# EAGLE design xnemo_r1-1 (EAGLE 6.2)
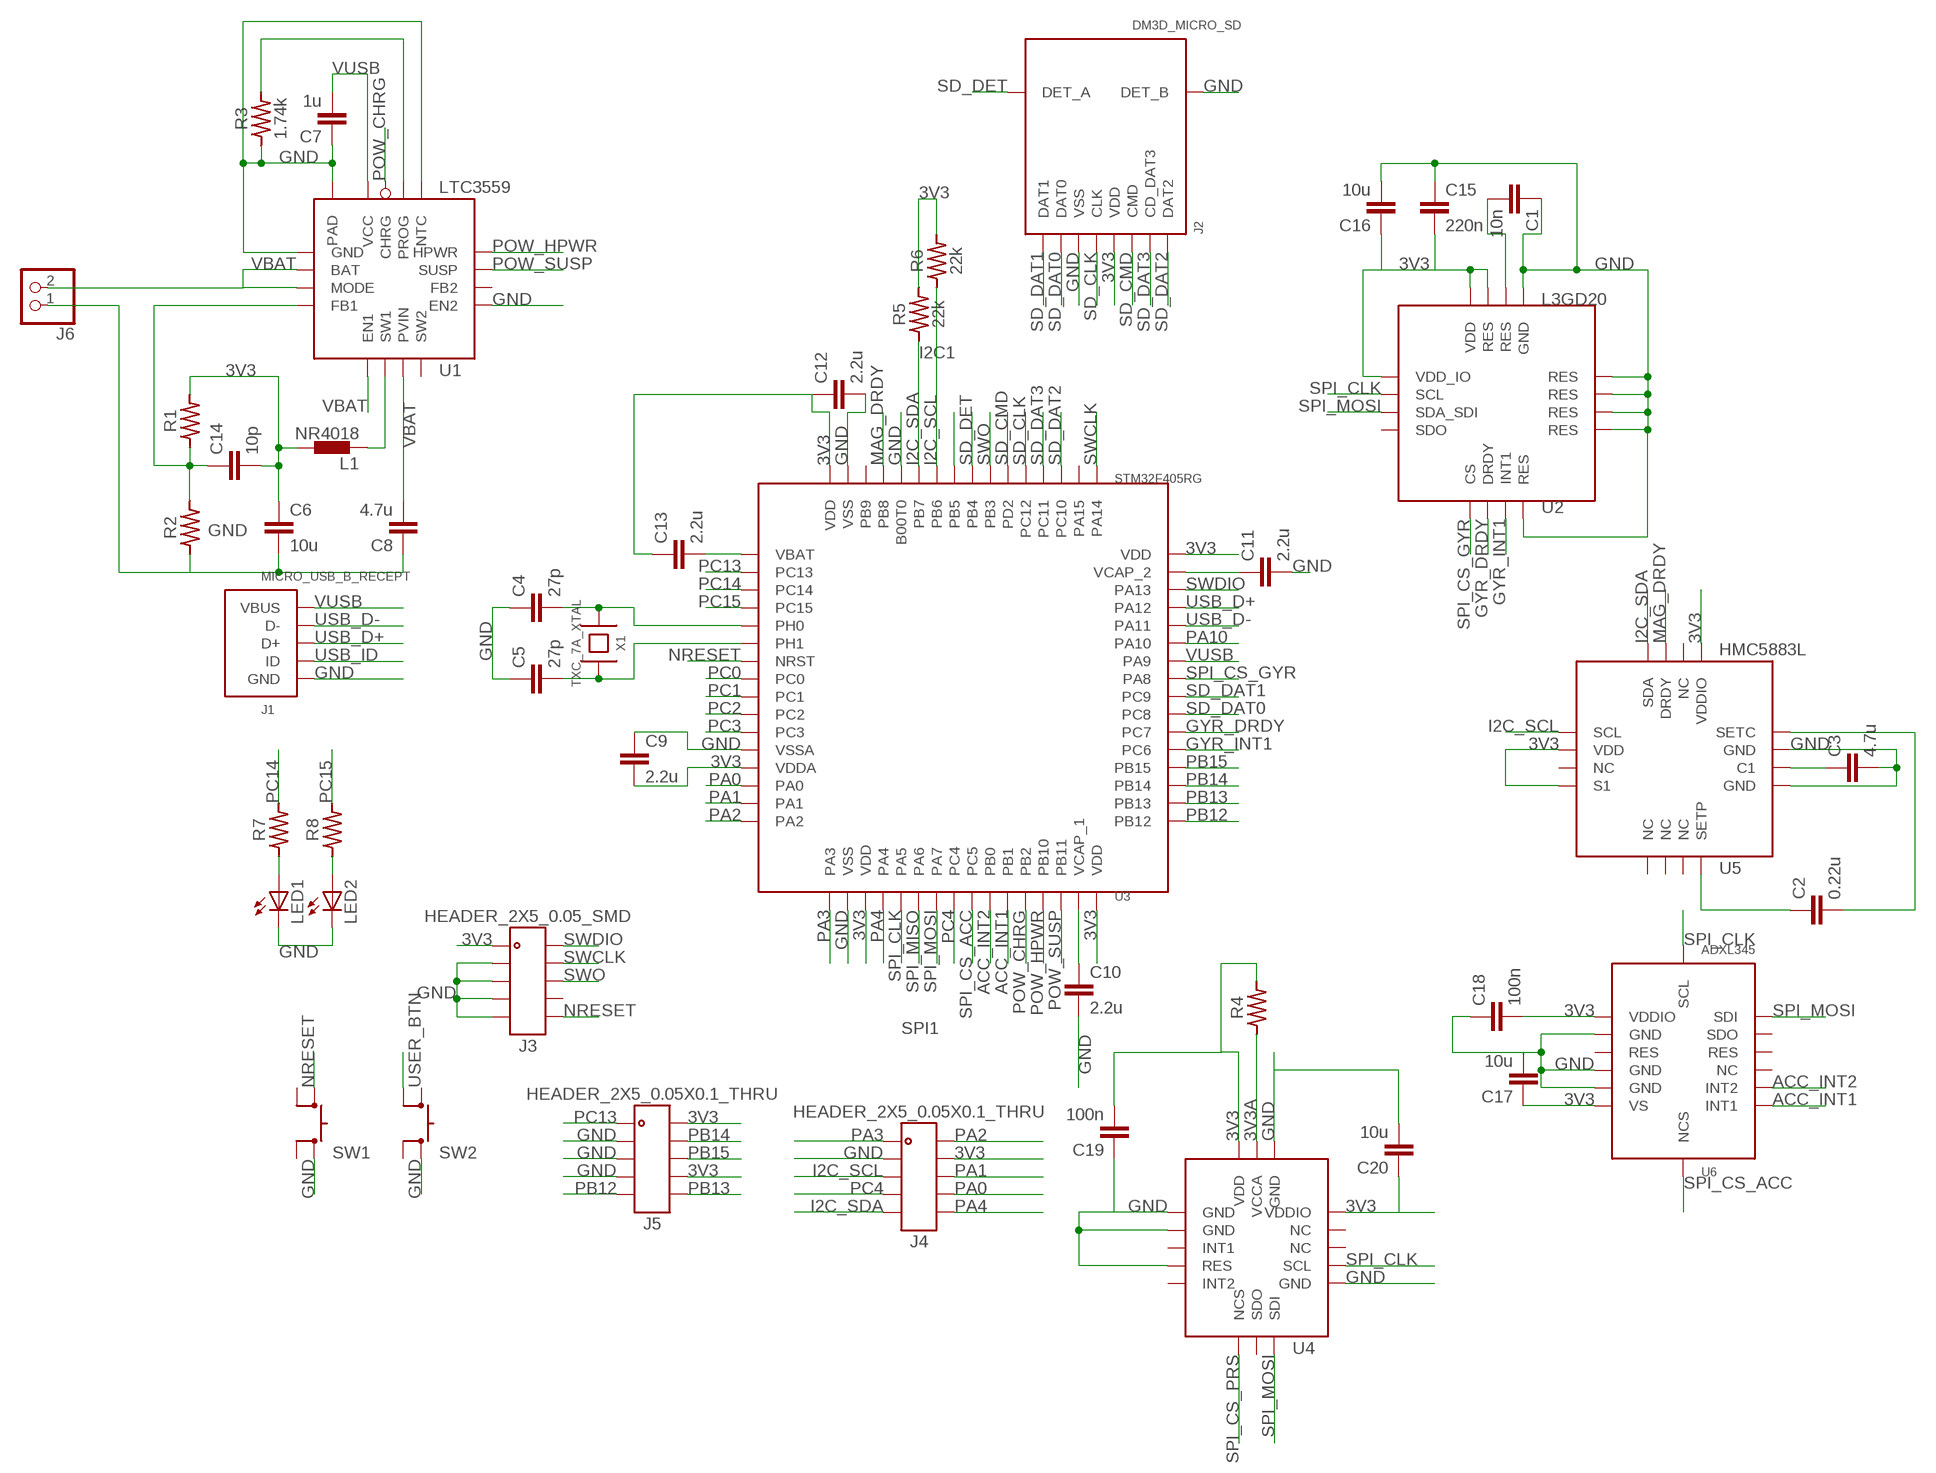
[diagram p0: schematic, sheet 1]

## Parts
C1  10n  C-EUC0402  [C0402]
C2  0.22u  C-EUC0402  [C0402]
C3  4.7u  C-EUC0805  [C0805]
C4  27p  C-EUC0402  [C0402]
C5  27p  C-EUC0402  [C0402]
C6  10u  C-EUC0805  [C0805]
C7  1u  C-EUC0603  [C0603]
C8  4.7u  C-EUC0805  [C0805]
C9  2.2u  C-EUC0603  [C0603]
C10  2.2u  C-EUC0603  [C0603]
C11  2.2u  C-EUC0603  [C0603]
C12  2.2u  C-EUC0603  [C0603]
C13  2.2u  C-EUC0603  [C0603]
C14  10p  C-EUC0402  [C0402]
C15  220n  C-EUC0402  [C0402]
C16  10u  C-EUC0805  [C0805]
C17  10u  C-EUC0805  [C0805]
C18  100n  C-EUC0402  [C0402]
C19  100n  C-EUC0402  [C0402]
C20  10u  C-EUC0805  [C0805]
J1  MICRO_USB_B_RECEPT  [FCI_MICRO_USB_B]
J2  DM3D_MICRO_SD  [HIROSE_DM3D]
J3  HEADER_2X5_0.05_SMD  [HEADER_2X5_0.05_SMD]
J4  HEADER_2X5_0.05X0.1_THRU  [HEADER_2X5_0.05X0.1_THRU]
J5  HEADER_2X5_0.05X0.1_THRU  [HEADER_2X5_0.05X0.1_THRU]
J6  PINHD-1X2  [1X02]
L1  NR4018  [L_401X]
LED1  LEDCHIPLED_0603  [CHIPLED_0603]
LED2  LEDCHIPLED_0603  [CHIPLED_0603]
R1  RESISTOR-0402  [SMD0402]
R2  RESISTOR-0402  [SMD0402]
R3  1.74k  RESISTOR-0402  [SMD0402]
R4  RESISTOR-0603  [SMD0603]
R5  22k  RESISTOR-0402  [SMD0402]
R6  22k  RESISTOR-0402  [SMD0402]
R7  RESISTOR-0402  [SMD0402]
R8  RESISTOR-0402  [SMD0402]
SW1  ALPS_SKQG  [ALPS_SKQG]
SW2  ALPS_SKQG  [ALPS_SKQG]
U1  LTC3559  [LT_QFN16_3X3]
U2  L3GD20  [ST_LGA16_4X4]
U3  STM32F405RG  [ST_LQFP64]
U4  LPS331AP  [ST_HCLGA-16L]
U5  HMC5883L  [HW_LCC16_3X3]
U6  ADXL345  [AD_LGA14_3X5]
X1  TXC_7A_XTAL  [TXC_7A_XTAL]

## Nets
3V3 [power]: C6.1 C9.2 C12.1 C13.1 C14.2 C15.2 C16.1 C17.1 C18.2 C19.2 C20.1 J2.P$5(VDD) J3.1 J4.4 J5.2 J5.8 L1.P$2 R1.P$1 R4.P$1 R5.P$1 R6.P$1 U2.P$1(VDD_IO) U2.P$15(RES) U2.P$16(VDD) U3.P$13(VDDA) U3.P$19(VDD) U3.P$32(VDD) U3.P$48(VDD) U3.P$64(VDD) U4.P$1(VDDIO) U4.P$14(VDD) U5.P$2(VDD) U5.P$4(S1) U5.P$13(VDDIO) U6.P$1(VDDIO) U6.P$6(VS)
3V3A: R4.P$2 U4.P$15(VCCA)
ACC_INT1: U3.P$27(PB1) U6.P$8(INT1)
ACC_INT2: U3.P$26(PB0) U6.P$9(INT2)
BUCK_FB1: C14.1 R1.P$2 R2.P$1 U1.P$4(FB1)
BUCK_SW1: L1.P$1 U1.P$6(SW1)
GND: C1.1 C3.2 C4.1 C5.1 C6.2 C7.1 C8.1 C9.1 C10.2 C11.2 C12.2 C15.1 C16.2 C17.2 C18.1 C19.1 C20.2 J1.P$5(GND) J2.P$3(VSS) J2.P$9(DET_B) J3.3 J3.5 J3.7 J3.9 J4.3 J5.3 J5.5 J5.7 J6.1 LED1.C LED2.C R2.P$2 R3.P$2 SW1.2_2 SW2.2_2 U1.P$1(GND) U1.P$9(EN2) U1.P$13(NTC) U1.P$17(PAD) U2.P$8(RES) U2.P$9(RES) U2.P$10(RES) U2.P$11(RES) U2.P$12(RES) U2.P$13(GND) U3.P$12(VSSA) U3.P$18(VSS) U3.P$60(B00T0) U3.P$63(VSS) U4.P$5(GND) U4.P$10(RES) U4.P$12(GND) U4.P$13(GND) U4.P$16(GND) U5.P$9(GND) U5.P$11(GND) U6.P$2(GND) U6.P$4(GND) U6.P$5(GND)
GYR_DRDY: U2.P$6(DRDY) U3.P$38(PC7)
GYR_INT1: U2.P$7(INT1) U3.P$37(PC6)
GYR_RES: C1.2 U2.P$14(RES)
I2C_SCL [data]: J4.5 R6.P$2 U3.P$58(PB6) U5.P$1(SCL)
I2C_SDA [data]: J4.9 R5.P$2 U3.P$59(PB7) U5.P$16(SDA)
MAG_C1: C3.1 U5.P$10(C1)
MAG_DRDY: U3.P$61(PB8) U5.P$15(DRDY)
MAG_SETC: C2.2 U5.P$12(SETC)
MAG_SETP: C2.1 U5.P$8(SETP)
N$2: LED1.A R7.P$2
N$3: LED2.A R8.P$2
NRESET: J3.10 SW1.1_2 U3.P$7(NRST)
OSC_IN: C4.2 U3.P$5(PH0) X1.P$2
OSC_OUT: C5.2 U3.P$6(PH1) X1.P$1
PA0: J4.8 U3.P$14(PA0)
PA1: J4.6 U3.P$15(PA1)
PA2: J4.2 U3.P$16(PA2)
PA3: J4.1 U3.P$17(PA3)
PA4: J4.10 U3.P$20(PA4)
PA10: U3.P$43(PA10)
PB12: J5.9 U3.P$33(PB12)
PB13: J5.10 U3.P$34(PB13)
PB14: J5.4 U3.P$35(PB14)
PB15: J5.6 U3.P$36(PB15)
PC0: U3.P$8(PC0)
PC1: U3.P$9(PC1)
PC2: U3.P$10(PC2)
PC3: U3.P$11(PC3)
PC4: J4.7 U3.P$24(PC4)
PC13: J5.1 U3.P$2(PC13)
PC14: R7.P$1 U3.P$3(PC14)
PC15: R8.P$1 U3.P$4(PC15)
POW_CHRG: U1.P$15(CHRG) U3.P$28(PB2)
POW_HPWR: U1.P$12(HPWR) U3.P$29(PB10)
POW_PROG: R3.P$1 U1.P$14(PROG)
POW_SUSP: U1.P$11(SUSP) U3.P$30(PB11)
SD_CLK: J2.P$4(CLK) U3.P$53(PC12)
SD_CMD: J2.P$6(CMD) U3.P$54(PD2)
SD_DAT0: J2.P$2(DAT0) U3.P$39(PC8)
SD_DAT1: J2.P$1(DAT1) U3.P$40(PC9)
SD_DAT2: J2.P$8(DAT2) U3.P$51(PC10)
SD_DAT3: J2.P$7(CD_DAT3) U3.P$52(PC11)
SD_DET: J2.P$10(DET_A) U3.P$56(PB4)
SPI_CLK [data]: U2.P$2(SCL) U3.P$21(PA5) U4.P$4(SCL) U6.P$14(SCL)
SPI_CS_ACC: U3.P$25(PC5) U6.P$7(NCS)
SPI_CS_GYR: U2.P$5(CS) U3.P$41(PA8)
SPI_CS_PRS: U4.P$8(NCS)
SPI_MISO: U3.P$22(PA6)
SPI_MOSI [data]: U2.P$3(SDA_SDI) U3.P$23(PA7) U4.P$6(SDI) U6.P$13(SDI)
SWCLK: J3.4 U3.P$49(PA14)
SWDIO: J3.2 U3.P$46(PA13)
SWO: J3.6 U3.P$55(PB3)
UC_VBAT: C13.2 U3.P$1(VBAT)
USB_D+: J1.P$3(D+) U3.P$45(PA12)
USB_D-: J1.P$2(D-) U3.P$44(PA11)
USB_ID: J1.P$4(ID)
USER_BTN: SW2.1_1 U3.P$57(PB5)
VBAT: C8.2 J6.2 U1.P$2(BAT) U1.P$3(MODE) U1.P$5(EN1) U1.P$7(PVIN)
VCAP_1: C10.1 U3.P$31(VCAP_1)
VCAP_2: C11.1 U3.P$47(VCAP_2)
VUSB [power]: C7.2 J1.P$1(VBUS) U1.P$16(VCC) U3.P$42(PA9)
Unconnected: J3.8 SW1.1_1 SW1.2_1 SW2.1_2 SW2.2_1 U1.P$8(SW2) U1.P$10(FB2) U2.P$4(SDO) U3.P$50(PA15) U3.P$62(PB9) U4.P$2(NC) U4.P$3(NC) U4.P$7(SDO) U4.P$9(INT2) U4.P$11(INT1) U5.P$3(NC) U5.P$5(NC) U5.P$6(NC) U5.P$7(NC) U5.P$14(NC) U6.P$3(RES) U6.P$10(NC) U6.P$11(RES) U6.P$12(SDO)

## Notes on the sheet
- I2C1
- SPI1

## Library data of the parts
C1-C20 = resistor:C-EU: CAPACITOR, European symbol
J1 = xnemo:MICRO_USB_B_RECEPT
J2 = xnemo:DM3D_MICRO_SD
J3-J5 = xnemo:HEADER_2X5
J6 = pinhead:PINHD-1X2: PIN HEADER
L1 = xnemo:NR4018: Taiyo Yuden NR401x SMT power inductor
LED1 LED2 = led:LED: LED OSRAM: - CHIPLED LG R971, LG N971, LY N971, LG Q971, LY Q971, LO R971, LY R971 LH N974, LH R974 LS Q976, LO Q976, LY Q976 LO Q996 - Hyper CHIPLED LW Q18S LB Q993, LB Q99A, LB R99A - SideLED LS A670, LO A670, LY A670, LG A670, LP A670 LB A673, LV A673, LT A673, LW A673 LH A674 LY A675 LS A676, LA A676, LO A676, LY A676, LW A676 LS A679, LY A679, LG A679 - Hyper Micro SIDELED® LS Y876, LA Y876, LO Y876, LY Y876 LT Y87S - SmartLED LW L88C, LW L88S LB L89C, LB L89S, LG L890 LS L89K, LO L89K, LY L89K LS L896, LA L896, LO L896, LY L896 - TOPLED LS T670, LO T670, LY T670, LG T670, LP T670 LSG T670, LSP T670, LSY T670, LOP T670, LYG T670 LG T671, LOG T671, LSG T671 LB T673, LV T673, LT T673, LW T673 LH T674 LS T676, LA T676, LO T676, LY T676, LB T676, LH T676, LSB T676, LW T676 LB T67C, LV T67C, LT T67C, LS T67K, LO T67K, LY T67K, LW E67C LS E67B, LA E67B, LO E67B, LY E67B, LB E67C, LV E67C, LT E67C LW T67C LS T679, LY T679, LG T679 LS T770, LO T770, LY T770, LG T770, LP T770 LB T773, LV T773, LT T773, LW T773 LH T774 LS E675, LA E675, LY E675, LS T675 LS T776, LA T776, LO T776, LY T776, LB T776 LHGB T686 LT T68C, LB T68C - Hyper Mini TOPLED® LB M676 - Mini TOPLED Santana® LG M470 LS M47K, LO M47K, LY M47K Source: http://www.osram.convergy.de LUXEON: - LUMILED® LXK2-PW12-R00, LXK2-PW12-S00, LXK2-PW14-U00, LXK2-PW14-V00 LXK2-PM12-R00, LXK2-PM12-S00, LXK2-PM14-U00 LXK2-PE12-Q00, LXK2-PE12-R00, LXK2-PE12-S00, LXK2-PE14-T00, LXK2-PE14-U00 LXK2-PB12-K00, LXK2-PB12-L00, LXK2-PB12-M00, LXK2-PB14-N00, LXK2-PB14-P00, LXK2-PB14-Q00 LXK2-PR12-L00, LXK2-PR12-M00, LXK2-PR14-Q00, LXK2-PR14-R00 LXK2-PD12-Q00, LXK2-PD12-R00, LXK2-PD12-S00 LXK2-PH12-R00, LXK2-PH12-S00 LXK2-PL12-P00, LXK2-PL12-Q00, LXK2-PL12-R00 Source: www.luxeon.com KINGBRIGHT: KA-3528ASYC Source: www.kingbright.com
R1-R8 = xnemo:RESISTOR
SW1 SW2 = xnemo:ALPS_SKQG: ALPS SKQG series tactile switch
U1 = xnemo:LTC3559: LTC3559 USB LiPo charger with dual buck switching regulators
U2 = xnemo:L3GD20
U3 = xnemo:STM32F405RG
U4 = xnemo:LPS331AP
U5 = xnemo:HMC5883L
U6 = xnemo:ADXL345
X1 = xnemo:TXC_7A_XTAL

## Net classes
0 default: width 0.203 mm, drill 0.305 mm, clearance 0.203 mm
1 power: width 0.305 mm, drill 0.356 mm, clearance 0.203 mm
2 data: width 0.254 mm, drill 0.305 mm, clearance 0.203 mm

## Board
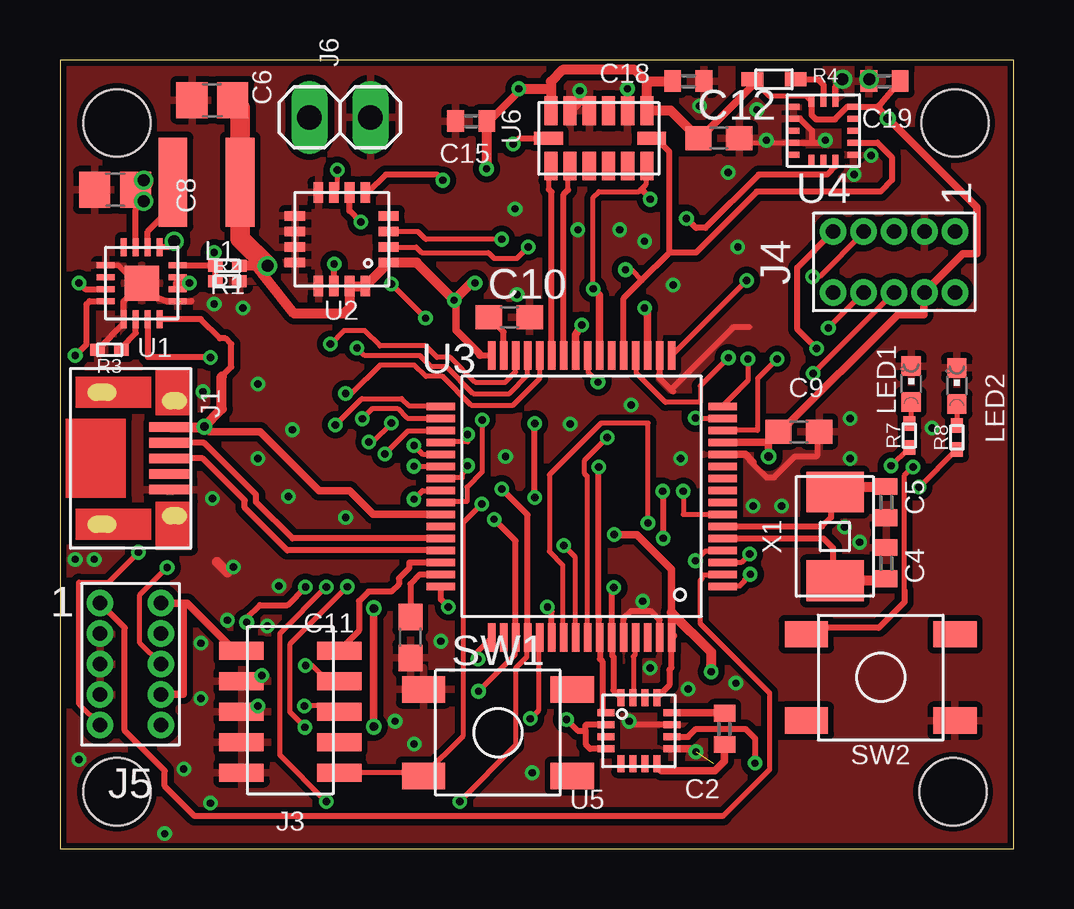
[diagram p1: board, top side]
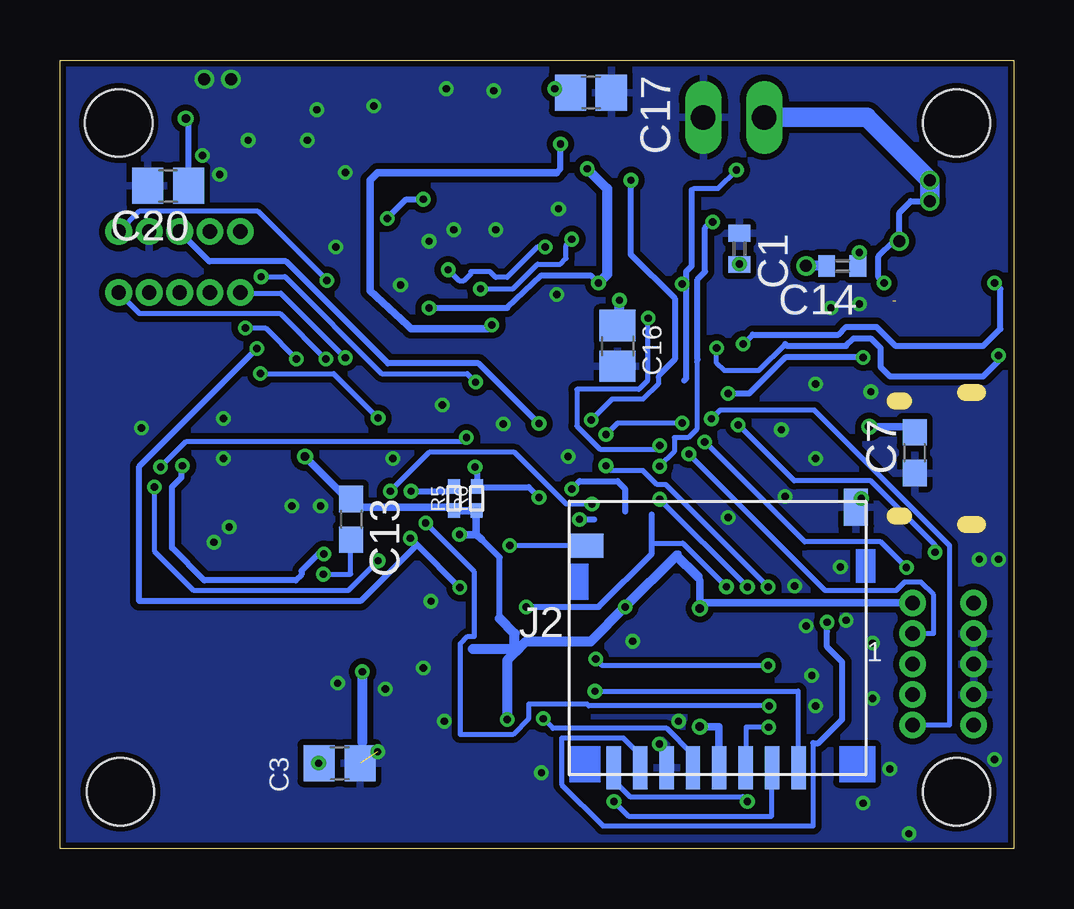
[diagram p2: board, bottom side, seen from below]

Size 39.75 x 32.86 mm. Coordinates in mm from the lower left corner, seen from the top.
Outline: 0,0 39.75,0 39.75,32.86 0,32.86 0,0
Copper layers (1*16): Top 0.035mm / dielectric 1.5mm / Bottom 0.035mm
Design rules: minimum track width 6mil, minimum drill 12mil, track to track 6mil, track to pad 6mil, pad to pad 6mil, via to via 6mil, smd to smd 0mil, copper to edge 10mil, drill to drill 10mil, minimum pad ring 10mil, minimum via ring 6mil, stop-mask expansion 2mil, vias tented up to drill 100mil, thermal gap 10mil
Holes 2.8 mm at 37.23,2.38 37.31,30.24 2.38,30.24 2.38,2.38

### Footprints (pad centres in the part's own frame; a part is rotated, then mirrored left to right if it is on the bottom)
C0402 = smd 0.7 x 0.9: 1 -0.65,0; 2 0.65,0
C0805 = smd 1.3 x 1.5: 1 -0.85,0; 2 0.85,0
C0603 = smd 1.1 x 1: 1 -0.85,0; 2 0.85,0
FCI_MICRO_USB_B = smd 0.4 x 1.75: P$1 -1.3,2.85; P$2 -0.65,2.85; P$3 0,2.85; P$4 0.65,2.85; P$5 1.3,2.85
HIROSE_DM3D = smd 0.6 x 1.8: P$1 -3.81,-5.98; P$2 -2.71,-5.98; P$3 -1.61,-5.98; P$4 -0.51,-5.98; P$5 0.59,-5.98; P$6 1.69,-5.98; P$7 2.79,-5.98; P$8 3.89,-5.98 | smd 1 x 1.55: P$9 6.29,4.87 | smd 1.45 x 1: P$10 -4.96,3.27
HEADER_2X5_0.05_SMD = smd 1.854 x 0.737: 1 -2.032,2.54; 2 2.032,2.54; 3 -2.032,1.27; 4 2.032,1.27; 5 -2.032,0; 6 2.032,0; 7 -2.032,-1.27; 8 2.032,-1.27; 9 -2.032,-2.54; 10 2.032,-2.54
HEADER_2X5_0.05X0.1_THRU = drill 0.6 pad 1.016: 1 -1.27,2.54; 2 1.27,2.54; 3 -1.27,1.27; 4 1.27,1.27; 5 -1.27,0; 6 1.27,0; 7 -1.27,-1.27; 8 1.27,-1.27; 9 -1.27,-2.54; 10 1.27,-2.54
1X02 = drill 1.016 long: 1 -1.27,0; 2 1.27,0
L_401X = smd 1.2 x 3.7: P$1 -1.4,0; P$2 1.4,0
CHIPLED_0603 = smd 0.8 x 0.8: A 0,-0.75; C 0,0.75
SMD0402 = smd 0.6 x 0.5: P$1 0.5,0; P$2 -0.5,0.01
SMD0603 = smd 0.9 x 0.6: P$1 0.9,0; P$2 -0.9,0
ALPS_SKQG = smd 1.8 x 1.1: 1_1 -3.1,1.8; 1_2 3.1,1.8; 2_1 -3.1,-1.8; 2_2 3.1,-1.8
LT_QFN16_3X3 = smd 0.75 x 0.25: P$1 -1.5,0.75; P$2 -1.5,0.25; P$3 -1.5,-0.25; P$4 -1.5,-0.75; P$9 1.5,-0.75; P$10 1.5,-0.25; P$11 1.5,0.25; P$12 1.5,0.75 | smd 0.25 x 0.75: P$5 -0.75,-1.5; P$6 -0.25,-1.5; P$7 0.25,-1.5; P$8 0.75,-1.5; P$13 0.75,1.5; P$14 0.25,1.5; P$15 -0.25,1.5; P$16 -0.75,1.5 | smd 1.45 x 1.45: P$17 0,0
ST_LGA16_4X4 = smd 0.85 x 0.4: P$1 -1.95,0.975; P$2 -1.95,0.325; P$3 -1.95,-0.325; P$4 -1.95,-0.975; P$9 1.95,-0.975; P$10 1.95,-0.325; P$11 1.95,0.325; P$12 1.95,0.975 | smd 0.4 x 0.85: P$5 -0.975,-1.95; P$6 -0.325,-1.95; P$7 0.325,-1.95; P$8 0.975,-1.95; P$13 0.975,1.95; P$14 0.325,1.95; P$15 -0.325,1.95; P$16 -0.975,1.95
ST_LQFP64 = smd 1.2 x 0.3: P$1 -5.875,3.75; P$2 -5.875,3.25; P$3 -5.875,2.75; P$4 -5.875,2.25; P$5 -5.875,1.75; P$6 -5.875,1.25; P$7 -5.875,0.75; P$8 -5.875,0.25; P$9 -5.875,-0.25; P$10 -5.875,-0.75; P$11 -5.875,-1.25; P$12 -5.875,-1.75; P$13 -5.875,-2.25; P$14 -5.875,-2.75; P$15 -5.875,-3.25; P$16 -5.875,-3.75; P$33 5.875,-3.75; P$34 5.875,-3.25; P$35 5.875,-2.75; P$36 5.875,-2.25; P$37 5.875,-1.75; P$38 5.875,-1.25; P$39 5.875,-0.75; P$40 5.875,-0.25; P$41 5.875,0.25; P$42 5.875,0.75; P$43 5.875,1.25; P$44 5.875,1.75; P$45 5.875,2.25; P$46 5.875,2.75; P$47 5.875,3.25; P$48 5.875,3.75 | smd 0.3 x 1.2: P$17 -3.75,-5.875; P$18 -3.25,-5.875; P$19 -2.75,-5.875; P$20 -2.25,-5.875; P$21 -1.75,-5.875; P$22 -1.25,-5.875; P$23 -0.75,-5.875; P$24 -0.25,-5.875; P$25 0.25,-5.875; P$26 0.75,-5.875; P$27 1.25,-5.875; P$28 1.75,-5.875; P$29 2.25,-5.875; P$30 2.75,-5.875; P$31 3.25,-5.875; P$32 3.75,-5.875; P$49 3.75,5.875; P$50 3.25,5.875; P$51 2.75,5.875; P$52 2.25,5.875; P$53 1.75,5.875; P$54 1.25,5.875; P$55 0.75,5.875; P$56 0.25,5.875; P$57 -0.25,5.875; P$58 -0.75,5.875; P$59 -1.25,5.875; P$60 -1.75,5.875; P$61 -2.25,5.875; P$62 -2.75,5.875; P$63 -3.25,5.875; P$64 -3.75,5.875
ST_HCLGA-16L = smd 0.5 x 0.25: P$1 1.25,1; P$2 1.25,0.5; P$3 1.25,0; P$4 1.25,-0.5; P$5 1.25,-1; P$9 -1.25,-1; P$10 -1.25,-0.5; P$11 -1.25,0; P$12 -1.25,0.5; P$13 -1.25,1 | smd 0.25 x 0.5: P$6 0.5,-1.25; P$7 0,-1.25; P$8 -0.5,-1.25; P$14 -0.5,1.25; P$15 0,1.25; P$16 0.5,1.25
HW_LCC16_3X3 = smd 0.7 x 0.3: P$1 -1.375,0.75; P$2 -1.375,0.25; P$3 -1.375,-0.25; P$4 -1.375,-0.75; P$9 1.375,-0.75; P$10 1.375,-0.25; P$11 1.375,0.25; P$12 1.375,0.75 | smd 0.3 x 0.7: P$5 -0.75,-1.375; P$6 -0.25,-1.375; P$7 0.25,-1.375; P$8 0.75,-1.375; P$13 0.75,1.375; P$14 0.25,1.375; P$15 -0.25,1.375; P$16 -0.75,1.375
AD_LGA14_3X5 = smd 1.2 x 0.55: P$1 -1.15,2; P$2 -1.15,1.2; P$3 -1.15,0.4; P$4 -1.15,-0.4; P$5 -1.15,-1.2; P$6 -1.15,-2; P$8 1.15,-2; P$9 1.15,-1.2; P$10 1.15,-0.4; P$11 1.15,0.4; P$12 1.15,1.2; P$13 1.15,2 | smd 0.55 x 1.2: P$7 0,-2.1; P$14 0,2.2
TXC_7A_XTAL = smd 1.7 x 2.4: P$1 -1.85,0; P$2 1.85,0

### Placement (x,y rotation side)
C1  11.43,25 270 bottom
C2  27.7,5 90 top
C3  28.1,3.57 0 bottom
C4  34.45,11.91 270 top
C5  34.45,14.45 90 top
C6  6.35,31.19 180 top
C7  4.13,16.51 90 bottom
C8  2.3,27.46 0 top
C9  30.8,17.38 180 top
C10  18.73,22.15 0 top
C11  14.61,8.81 270 top
C12  27.46,29.61 0 top
C13  27.62,13.73 270 bottom
C14  7.14,24.29 180 bottom
C15  17.14,30.32 0 top
C16  16.51,20.95 270 bottom
C17  17.62,31.51 0 bottom
C18  26.19,31.99 180 top
C19  34.37,31.99 0 top
C20  35.24,27.62 180 bottom
J1  1.75,16.27 270 top
J2  12.86,9.37 0 bottom
J3  9.6,5.71 0 top
J4  34.77,24.45 270 top
J5  2.94,7.7 0 top
J6  11.67,30.48 180 top
L1  6.11,27.78 0 top
LED1  35.48,19.37 0 top
LED2  37.39,19.29 0 top
R1  6.99,24.29 0 top
R2  6.99,23.65 180 top
R3  2.06,20.8 0 top
R4  29.77,32.07 180 top
R5  23.34,14.61 270 bottom
R6  22.38,14.61 270 bottom
R7  35.4,17.22 270 top
R8  37.39,17.14 270 top
SW1  18.26,4.84 180 top
SW2  34.21,7.14 0 top
U1  3.41,23.57 180 top
U2  11.75,25.4 180 top
U3  21.75,14.68 180 top
U4  31.83,29.92 0 top
U5  24.13,4.92 0 top
U6  22.46,29.61 270 top
X1  32.31,13.02 270 top

### Tracks (layer width: path | path; a pad name or v marks a point on that pad's centre or on a via)
3V3  (via drill 0.3, 0.3 pad 0.25, 0.36, 0.5)
  Top 0.203: U4.P$14 31.29,31.17 31.11,31.35 29.58,31.35 R4.P$1
  Top 0.254: 17.51,20.56 U3.P$32 | v16.19,10.08 15.88,10.4 U3.P$48 | U3.P$64 25.5,7.56 25.4,7.46 25.4,6.82 U5.P$13 | C19.2 34.12,30.92 U4.P$1 32.83,30.92 32.31,30.4 31.51,30.4 31.33,30.58 U4.P$14 | U5.P$2 21.91,5.17 21.91,4.93 | v21.11,5.4 21.58,4.93 21.91,4.93 | U5.P$4 22.1,4.17 21.91,4.37 21.91,4.93 | 34.16,30.8 34.16,30.78 v34.51,30.43
  Top 0.305: U3.P$19 24.5,22.41 v24.37,22.54 | U3.P$13 29.5,16.93 | 29.5,16.93 C9.2 30.1,17.44 34.92,22.27 36.02,22.27 36.02,23.16 J4.4 36.14,23.28 36.37,23.51 36.37,23.54 37.64,24.81 38.23,24.81 38.23,26.74 34.16,30.8 34.12,30.92 | v23.1,13.1 24.05,13.1 25.5,11.65 25.5,9.84 U3.P$64 25.58,8.89 | 17.51,20.56 17.45,20.67 16.51,21.61 16.51,22.67 v16.43,22.86 | C15.2 17.98,30.42 19.05,31.49 v19.13,31.67 | R4.P$1 28.93,31.87 26.8,29.73 26.8,29.71 C12.1 | 5.13,10.23 4.22,10.23 J5.2 | 5.13,10.23 5.3,10.23 7.25,8.27 J3.1 | 5.13,10.23 5.13,6.44 4.22,6.44 J5.8 | v13.08,10.02 v13.08,5.1 | v29.54,16.35 29.54,16.8 29.5,16.93
  Top 0.406: C15.2 17.78,30.31 v17.78,28.34 | 24.46,31.97 U6.P$1 25.46,30.76 C12.1 | 24.46,31.97 23.97,32.46 20.95,32.46 20.46,31.97 20.46,31.67 | 20.46,31.67 U6.P$6 | C18.2 25.53,31.97 24.46,31.97 | v19.13,31.67 20.46,31.67 | v17.3,23.57 17.14,23.57 v16.43,22.86 14.87,24.43 U2.P$1 U2.P$16 U2.P$15 12.06,22.54 11.83,22.3 9.76,22.3 8.18,24.29 | 8.18,24.29 v8.65,24.29 | 8.18,24.29 R1.P$1 | v27.15,7.38 27.15,8.2 25.5,9.84
  Top 0.813: C6.1 7.51,30.88 L1.P$2 7.51,25.43 v8.65,24.29
  Bottom 0.254: v24.37,22.54 21.11,22.54 19.68,23.89 17.62,23.89 v17.3,23.57 | 20.8,8.18 20.72,8.26 20.78,8.32 | 13.97,12.3 14.05,12.22 | 21.43,9.6 21.43,12.14 22.18,12.9 | C20.1 34.39,30.34 34.42,30.34 v34.51,30.43 34.51,30.45 34.51,30.46
  Bottom 0.305: v23.1,13.1 22.38,13.1 | 22.38,13.1 22.18,12.9 | 22.38,13.1 22.4,13.22 22.4,14.09 R6.P$1 22.55,14.09 23.32,14.09 R5.P$1 23.42,14.24 27.28,14.24 C13.1 27.76,14.65 27.84,14.65 v29.54,16.35 | v13.08,5.1 12.29,5.1 12.29,3.39 J2.P$5 | 13.18,11.35 13.08,11.17 v13.08,10.02 12.95,10.25 4.22,10.25 J5.2
  Bottom 0.406: v17.78,28.34 16.95,27.51 16.95,23.93 v17.3,23.57 | 20.64,8.33 20.32,8.65 17.62,8.65 v16.19,10.08 14.05,12.22 13.18,11.35 | 21.43,9.6 20.8,8.97 20.8,8.18 21.11,7.86 v21.11,5.4 | 22.54,8.33 20.64,8.33 | 20.64,8.33 20.72,8.26 | 27.15,4.45 v27.15,7.38 | C16.1 16.43,21.88 v16.43,22.86 | C17.1 18.63,31.67 v19.13,31.67 | C14.2 v8.65,24.29
3V3A
  Top 0.254: R4.P$2 31.59,32.07 31.83,31.83 U4.P$15
ACC_INT1
  Top 0.203: 20.38,27.48 20.38,28.38 U6.P$8
  Top 0.254: U3.P$27 20.5,27.36 20.38,27.48
ACC_INT2
  Top 0.203: 21.18,27.45 21.18,28.38 U6.P$9
  Top 0.254: U3.P$26 21,27.27 21.18,27.45
BUCK_FB1  (via drill 0.3)
  Top 0.254: U1.P$4 6.46,24.32 R1.P$2 | R2.P$1 R1.P$2 | v6.43,24.84 6.43,24.35 R1.P$2
  Bottom 0.254: C14.1 6.49,24.78 v6.43,24.84
BUCK_SW1
  Top 0.254: U1.P$6 3.66,25.73 4.6,26.67 4.6,27.67 L1.P$1
GND  (via drill 0.3 pad 0.25, 0.5 pad 0.25)  (2 unrouted)
  Top 0.203: U1.P$9 2.42,24.32 2.94,23.81 3.17,23.81 U1.P$17 | U4.P$10 30.56,29.43 28.32,29.43 28.32,29.61 C12.2
  Top 0.254: U3.P$63 25,9.53 24.61,9.92 23.81,9.92 23.5,9.61 U3.P$60 | U3.P$18 25,19.61 25.56,19.05 25.56,19.21 28.1,21.75 28.73,21.75 | U5.P$11 23.88,5.17 v23.73,5.32 | U4.P$16 32.33,31.77 v32.62,32.07 | R3.P$2 2.66,21.91 U1.P$13 2.66,22.82 U1.P$17 4.05,22.94 4.13,22.94 4.48,22.82 U1.P$1 | 5.04,22.82 5.47,22.82 | J3.5 8.02,5.71 v8.26,5.95 | 28.89,16.11 28.89,16.03 29.45,15.48 29.77,15.48 30.64,16.35 31.51,16.35 31.59,16.43 31.59,17.33 C9.1 | 30.56,29.43 31.35,29.43 | 31.35,29.43 31.81,29.43 v31.91,29.53 | U4.P$12 30.85,30.42 31.35,29.92 31.35,29.43
  Top 0.305: U3.P$12 28.57,16.43 28.89,16.11 | U5.P$9 26.4,4.17 v26.51,4.05
  Top 0.406: 6.54,11.96 6.99,11.51 | U6.P$5 21.67,31.16 v21.67,31.59
  Bottom 0.254: 19.62,3.19 19.68,3.25
  Bottom 0.305: J2.P$3 14.47,4.07 v14.76,4.37
  other vias: 19.05,23.1 33.73,32.07 5.87,8.57 5.87,6.27 5.16,3.33 4.37,0.64 6.27,1.91 0.79,3.73 7.22,11.75 9.13,10.95 6.35,14.61 1.43,12.06 0.64,12.06 9.53,14.68 8.26,16.27 8.26,19.37 11.91,13.81 9.68,17.46 5.95,19.05 7.62,22.54 6.43,22.7 13.97,5.32 24.29,10.32 24.61,7.54 19.68,3.17 15.88,8.65 8.65,9.29 6.99,9.53 8.41,7.22 32.94,17.94 32.94,16.27 36.35,17.54 32.7,13.41 28.89,14.29 30.08,14.29 33.34,12.78 26.67,30.96 29.45,29.53 29.05,30.8 27.86,28.18 23.65,31.67 33.1,28.1 33.81,28.89 23.34,25.8 18.97,26.67 21.59,25.8 24.37,25.32 25.56,23.5 28.26,25.08 23.81,18.49 21.27,17.7 18.57,16.35 25.88,16.27 26.19,6.67 28.18,6.91
  pour Top (isolate 0.254): 0,32.86 39.77,32.86 39.77,0 0,0
  pour Bottom (isolate 0.254): 0,32.86 39.77,32.86 39.77,0 0,0
GYR_DRDY  (via drill 0.3, 0.3 pad 0.25)
  Top 0.203: v14.76,15.94 15.85,15.94 U3.P$38
  Top 0.254: v12.54,26.11 12.07,26.58 U2.P$6
  Bottom 0.203: v14.76,15.94 14.15,16.55 14.15,17.14 13.56,17.14 13.21,17.49 13.21,20.29 13.18,20.4
  Bottom 0.254: 13.18,20.4 13.18,23.73 12.86,24.05 12.86,25.88 12.62,26.11 v12.54,26.11
GYR_INT1  (via drill 0.3)
  Top 0.203: v11.56,28.29 11.56,27.5 11.43,27.37 U2.P$7 | v14.76,16.8 15.11,16.45 15.85,16.45 U3.P$37 | v13.82,23.54 v15.24,22.11
  Bottom 0.203: v11.56,28.29 12.32,27.52 13.31,27.52 13.41,27.46 | v14.76,16.8 14.91,16.65 17.25,16.65 18.21,17.62 18.21,19.14 15.62,19.14 15.27,19.5 15.27,22.11 v15.24,22.11 | v13.82,23.54 13.65,23.54
  Bottom 0.254: 13.73,19.53 13.65,19.61 13.65,23.54 13.65,24.05 13.41,24.29 13.41,27.46
GYR_RES  (via drill 0.3 pad 0.25)
  Top 0.254: U2.P$14 v11.43,24.37
  Bottom 0.254: C1.2 v11.43,24.37
I2C_SCL  (via drill 0.3)
  Top 0.254: v22.45,15.92 22.45,9.59 22.48,9.57 22.48,8.83 U3.P$58 22.5,8.7 22.5,7.92 22.61,7.81 22.61,5.81 22.73,5.68 U5.P$1 | v19.79,14.65 v19.79,17.72
  Bottom 0.254: v22.45,15.92 22.38,15.92 22.38,15.13 R6.P$2 22.25,15.08 20.22,15.08 v19.79,14.65 | v19.79,17.72 22.3,20.23 26.09,20.23 30.33,24.48 33.53,24.48 34.75,25.7 J4.5
I2C_SDA  (via drill 0.3)
  Top 0.254: v25.12,14.9 25.15,14.88 v25.15,12.94 | v23.09,10.89 23.01,10.81 23.01,8.83 U3.P$59 23.01,8.7 23.01,8.07 23.06,8.02 23.06,6.62 23.37,6.32 U5.P$16 | v31.55,20.84 30.73,21.66 30.73,24.22 32.21,25.7 J4.9
  Bottom 0.254: v25.12,14.9 23.55,14.9 23.34,15.1 R5.P$2 | v23.09,10.89 24.88,12.68 | 24.88,12.68 v25.15,12.94 | v31.55,20.84 36.45,15.94 36.45,10.33 27.23,10.33 24.88,12.68
MAG_C1  (via drill 0.3)
  Top 0.254: U5.P$10 26.18,4.67 26.51,5 28.57,5 28.97,4.6 v28.97,3.57
  Bottom 0.254: C3.1 v28.97,3.57
MAG_DRDY
  Top 0.203: U5.P$15 23.9,6.32 23.9,8.02 23.98,8.09 23.98,8.8 U3.P$61
MAG_SETC
  Top 0.305: U5.P$12 27.68,5.67 C2.2
MAG_SETP
  Top 0.305: U5.P$8 24.88,3.46 25.08,3.25 27.3,3.25 27.7,3.65 C2.1
N$2
  Top 0.203: R7.P$2 35.43,17.75 35.46,17.77 35.46,18.61 LED1.A
N$3
  Top 0.203: R8.P$2 37.39,17.67 LED2.A
NRESET  (via drill 0.3)
  Top 0.203: v25.98,14.9 25.98,13.94 U3.P$7 | v17.58,14.37 16.82,13.61 16.82,4.71 15.16,3.06 SW1.1_2 15.14,3.17 11.66,3.17 J3.10
  Bottom 0.203: v25.98,14.9 24.36,16.53 20.8,16.53 18.64,14.37 v17.58,14.37
OSC_IN
  Top 0.254: U3.P$5 31.83,12.93 32.23,12.54 32.23,11.25 X1.P$2
  Top 0.406: C4.2 34.36,11.17 X1.P$2
OSC_OUT
  Top 0.254: U3.P$6 31.77,13.43 32.15,13.81 32.15,14.71 X1.P$1
  Top 0.406: X1.P$1 32.53,15.1 C5.2
PA0  (via drill 0.3)
  Top 0.203: v29.9,20.41 29.08,19.6 29.08,17.44 27.64,17.44 U3.P$14 | v32.03,21.71 33.48,23.16 J4.8
  Bottom 0.203: v29.9,20.41 31.19,21.71 v32.03,21.71
PA1  (via drill 0.3)
  Top 0.203: v26.49,17.95 27.61,17.95 U3.P$15 | v31.39,19.8 34.75,23.16 J4.6
  Bottom 0.203: v26.49,17.95 28.35,19.8 v31.39,19.8
PA2  (via drill 0.3)
  Top 0.203: v28.68,20.41 28.68,19.5 27.64,18.46 U3.P$16
  Bottom 0.203: v28.68,20.41 30.58,22.32 36.45,22.32 37.29,23.16 J4.2
PA3  (via drill 0.3)
  Top 0.203: v28.63,23.69 U3.P$17
  Bottom 0.203: v28.63,23.69 31.52,26.58 36.42,26.58 37.29,25.72 J4.1
PA4  (via drill 0.3)
  Top 0.203: v27.86,20.46 26.7,19.29 26.7,18.61 25.25,18.61 24.03,19.83 24.03,20.51 24,20.54 U3.P$20
  Bottom 0.203: v27.86,20.46 30.56,23.16 32.21,23.16 J4.10
PB12  (via drill 0.3)
  Top 0.203: v11.48,17.67 12.57,18.76 14.25,18.76 14.55,18.46 15.85,18.46 U3.P$33 | v3.28,12.36 2.03,11.12 0.79,11.12 0.79,6.04 1.65,5.17 J5.9
  Bottom 0.203: v11.48,17.67 9.14,15.33 5.94,15.33 3.28,12.66 v3.28,12.36
PB13  (via drill 0.3)
  Top 0.203: v12.6,17.92 13.03,18.36 14.07,18.36 14.48,17.95 15.85,17.95 U3.P$34
  Bottom 0.203: v12.6,17.92 12.24,18.28 8.31,18.28 2.67,12.64 2.67,5.17 4.19,5.17 J5.10
PB14  (via drill 0.3)
  Top 0.203: v13.54,16.45 14.5,17.41 15.85,17.41 U3.P$35
  Bottom 0.203: v13.54,16.45 7.85,10.76 4.9,10.76 4.55,11.12 3.86,11.12 3.33,10.58 3.33,8.98 4.19,8.98 J5.4
PB15  (via drill 0.3)
  Top 0.203: v16.99,17.26 16.99,16.96 15.88,16.96 U3.P$36 | v13.82,17.75 13.03,16.96 v12.88,16.96 | v4.47,11.72 3.33,10.58 3.33,8.58 4.19,7.71 J5.6
  Bottom 0.203: v16.99,17.26 16.51,17.75 v13.82,17.75 | v12.88,16.96 8.71,12.79 5.54,12.79 v4.47,11.72
PC4  (via drill 0.3)
  Top 0.203: v22.43,19.45 22.02,19.85 22.02,20.54 U3.P$24 | v31.37,23.84 31.67,23.84 33.48,25.64 33.48,25.7 J4.7
  Bottom 0.203: v22.43,19.45 22.78,19.8 26.34,19.8 30.38,23.84 v31.37,23.84
PC13
  Top 0.203: 27.64,1.36 29.59,3.32 29.59,6.49 26.7,9.39 26.7,11.19 26.77,11.27 26.77,11.42 U3.P$2 | 2.46,9.44 2.54,9.36 | 1.68,10.23 J5.1
  Top 0.254: 1.68,10.23 2.46,9.44 2.7,9.2 2.7,4.92 4.37,3.25 4.37,2.62 5.62,1.36 27.64,1.36
PC14  (via drill 0.3)
  Top 0.203: v34.65,15.97 35.38,16.7 R7.P$1 | v28.75,12.28 28.42,11.95 27.64,11.95 U3.P$3
  Bottom 0.254: v28.75,12.28 28.99,12.28 29.69,11.59 29.69,11.43 29.92,11.19 33.73,11.19 35.08,12.54 35.08,15.08 34.69,15.48 34.69,15.93 v34.65,15.97
PC15  (via drill 0.3)
  Top 0.203: v35.81,15.08 37.36,16.63 R8.P$1 | v26.49,12.01 26.9,12.41 27.61,12.41 U3.P$4
  Bottom 0.203: v26.49,12.01 27.74,10.76 34.18,10.76 35.8,12.38 35.8,15.06 v35.81,15.08
POW_CHRG  (via drill 0.3, 0.3 pad 0.25)
  Top 0.203: U3.P$28 20,19.61 18.89,18.49 17.14,18.49 15.95,19.68 15.24,19.68 14.76,20.16 13.34,20.16 12.14,18.97 v11.91,18.97
  Top 0.254: U3.P$28 | U1.P$15 3.66,20.49 v6.26,20.49 v6.27,20.48
  Bottom 0.254: v6.27,20.48 9.53,20.48 11.03,18.97 v11.91,18.97
POW_HPWR  (via drill 0.3)
  Top 0.203: U3.P$29 19.5,19.74 18.73,18.97 17.22,18.97 16.11,20.08 15.48,20.08 15,20.56 12.7,20.56 v12.38,20.88
  Top 0.254: 19.53,20.53 U3.P$29 | v0.64,20.56 1.11,21.03 1.11,22.7 1.23,22.82 U1.P$12
  Bottom 0.203: 9.53,21.03 10.64,19.92 12.06,19.92 12.38,20.24 v12.38,20.88
  Bottom 0.254: 9.53,21.03 9.45,20.95 6.99,20.95 6.67,21.27 5.95,21.27 5.56,20.88 5.56,20.08 5.16,19.68 1.27,19.68 0.64,20.32 v0.64,20.56
POW_PROG
  Top 0.254: R3.P$1 2.56,20.9 3.16,21.5 U1.P$14
POW_SUSP  (via drill 0.3)
  Top 0.203: U3.P$30 19,19.87 18.57,19.45 17.3,19.45 16.27,20.48 15.72,20.48 15.24,20.95 13.34,20.95 12.7,21.59 11.83,21.59 v11.27,21.03
  Top 0.254: v0.79,23.57 1.04,23.32 U1.P$11
  Bottom 0.203: v11.27,21.03 10.87,21.43
  Bottom 0.254: 10.87,21.43 7.3,21.43 6.99,21.75 5.71,21.75 4.92,20.95 1.27,20.95 0.56,21.67 0.56,23.34 v0.79,23.57
SD_CLK  (via drill 0.3)
  Top 0.203: v19.61,5.43 19.96,5.78 19.96,8.78 U3.P$53
  Bottom 0.203: v19.61,5.43 19.2,5.02 14.45,5.02 13.39,3.95 13.39,3.39 J2.P$4
SD_CMD  (via drill 0.3)
  Top 0.203: v10.21,5.07 9.58,5.71 9.58,8.53 v11.97,10.92
  Top 0.254: U3.P$54 20.5,9.9 v20.32,10.08
  Bottom 0.203: v10.21,5.07 11.15,5.07 11.15,3.39 J2.P$6 | v11.97,10.92 13.79,12.74 15.08,12.74
  Bottom 0.254: v20.32,10.08 17.3,10.08 15.08,12.3 15.08,12.74 15.08,13.94
SD_DAT0  (via drill 0.3)
  Top 0.203: v16.99,15.97 16.99,15.87 16.76,15.64 16.76,15.46 15.88,15.46 U3.P$39
  Top 0.254: v7.78,9.45 7.78,9.6 8.33,10.16 9.48,10.16 v10.24,10.91
  Bottom 0.203: v16.99,15.97 16.79,15.76 15.44,15.76 14.86,15.18 14.5,15.18 v10.24,10.91 | 8.36,4.41 8.36,0.96 17.12,0.96 18.85,2.68 18.85,4.61 16.26,4.61 15.57,3.93 J2.P$2
  Bottom 0.254: 7.78,9.05 v7.78,9.45 7.78,8.41 7.14,7.78 7.14,5.4 8.13,4.41 8.36,4.41
SD_DAT1  (via drill 0.3)
  Top 0.203: v14.76,14.57 15.11,14.93 15.85,14.93 U3.P$40 | v11.1,10.91 9.17,8.98 9.17,3.9 v11.1,1.97
  Bottom 0.203: v11.1,10.91 v14.76,14.57 | v11.1,1.97 11.3,2.17 16,2.17 16.66,2.83 16.66,3.37 J2.P$1
SD_DAT2  (via drill 0.3, 0.3 pad 0.25)
  Top 0.203: v17.45,6.57 18.97,8.09 18.97,8.7 U3.P$51
  Top 0.254: U3.P$51 19,12.83 v18.1,13.73
  Bottom 0.203: v17.45,6.57 8.99,6.57 8.99,3.39 J2.P$8
  Bottom 0.254: v18.1,13.73 17.49,13.73
SD_DAT3  (via drill 0.3, 0.3 pad 0.25)
  Top 0.203: v16.66,1.97 19,4.31 19,7.53 19.46,7.99 19.46,8.7 U3.P$52
  Top 0.254: U3.P$52 19.5,13.92 v18.41,15
  Bottom 0.203: v16.66,1.97 16.05,1.36 10.08,1.36 10.08,3.37 J2.P$7
  Bottom 0.254: v18.41,15 18.1,15.32 16.51,15.32 16.19,15 16.19,14.06
SD_DET  (via drill 0.3)
  Top 0.203: v21.01,12.64 21.46,12.18 21.46,8.86 21.49,8.83 U3.P$56
  Bottom 0.203: v21.01,12.64 J2.P$10
SPI_CLK  (via drill 0.3 pad 0.25)
  Top 0.203: U2.P$2 14.85,25.07 15.08,24.84 17.86,24.84 18.1,24.61 19.05,24.61 v19.53,25.08 | v23.57,24.13 23.81,24.13 24.25,23.69
  Top 0.254: U3.P$21 23.5,22.94 24.25,23.69 25.4,24.84 | U4.P$4 34.08,29.42 34.69,28.81 34.69,27.86 34.21,27.38 29.05,27.38 26.51,24.84 25.4,24.84 | 25.4,24.84 25.4,29.05 24.84,29.61 U6.P$14
  Bottom 0.203: v19.53,25.08 19.84,25.08 21.11,23.81 21.59,23.81 21.83,24.05 22.62,24.05 22.62,23.97 22.94,23.65 23.1,23.65 v23.57,24.13
SPI_CS_ACC  (via drill 0.3, 0.3 pad 0.25)
  Top 0.254: v18.89,29.37 19.13,29.61 U6.P$7
  Top 0.305: U3.P$25 21.5,21.42 v21.75,21.83
  Bottom 0.254: 19.05,28.18 18.89,28.34 v18.89,29.37
  Bottom 0.305: 19.05,28.18 26.51,28.18 26.83,27.86 26.83,23.26 25.26,21.82 25.11,21.67 21.91,21.67 v21.75,21.83
SPI_CS_GYR  (via drill 0.3, 0.3 pad 0.25)
  Top 0.203: v17.6,17.87 17.6,15.71 16.97,15.08 16.97,14.47 16,14.47 U3.P$41
  Top 0.254: 15.89,14.45 U3.P$41 | v15.95,27.86 15.72,28.1 13.57,28.1 12.82,27.35 U2.P$5
  Bottom 0.203: v17.6,17.87 16.74,18.74 15.44,18.74 14.81,19.37 14.81,19.65 14.76,19.76
  Bottom 0.254: 14.76,19.76 14.13,20.4 14.13,22.94 15.95,24.77 v15.95,27.86
SPI_MOSI  (via drill 0.3, 0.3 pad 0.25)
  Top 0.203: v18.41,25.4 15.24,25.4 14.92,25.72 U2.P$3 | v22.23,23.34 22.23,27.15 22.46,27.38 24.13,27.38 24.21,27.46 24.45,27.7 24.45,28.44 U6.P$13
  Top 0.254: U4.P$6 32.33,28.44 31.99,28.1 29.13,28.1 26.91,25.88 26.51,25.88 v26.11,26.27 | v24.61,27.07 24.29,27.46 24.21,27.46
  Top 0.305: U3.P$23 22.5,23.06 v22.23,23.34
  Bottom 0.203: v22.23,23.34 20.88,23.34 19.84,24.37 18.89,24.37 18.65,24.61 18.65,25.16 v18.41,25.4
  Bottom 0.254: v26.11,26.27 25.32,27.07 v24.61,27.07
SWCLK  (via drill 0.3)
  Top 0.203: v17.42,7.92 17.42,8.24 17.98,8.8 U3.P$49 | v10.24,7.64 10.52,7.64 11.15,7 11.63,7 J3.4
  Bottom 0.203: v17.42,7.92 17.14,7.64 v10.24,7.64
SWDIO
  Top 0.254: U3.P$46 14.55,11.93 14.55,11.7 14.13,11.27 14.13,11.03 13.81,10.72 12.86,10.72 12.46,10.32 12.46,9.08 J3.2
SWO  (via drill 0.3)
  Top 0.203: v24.51,13.58 24.51,17.75 22.55,17.75 20.4,15.59 20.4,12.39 20.95,11.83 20.95,8.86 20.98,8.83 U3.P$55 | v10.19,5.96 11.63,5.96 11.63,5.73 J3.6
  Bottom 0.203: v24.51,13.58 22.48,11.55 22.48,8.86 22.76,8.86 23.06,8.55 23.06,4.77 20.88,4.77 20.22,5.43 20.22,6.04 17.78,6.04 17.7,5.96 v10.19,5.96
UC_VBAT  (via drill 0.3)
  Top 0.203: v28.78,11.45 28.55,11.22 28.55,11.17 28.35,10.96 27.79,10.96 U3.P$1
  Top 0.305: 27.64,10.95 U3.P$1
  Bottom 0.203: v28.78,11.45 27.64,11.45 27.64,12.87 C13.2
USB_D+
  Top 0.254: U3.P$45 9.47,12.43 7.7,14.21 7.7,14.53 5.95,16.27 J1.P$3
USB_D-
  Top 0.254: U3.P$44 9.69,12.93 8.18,14.45 8.18,14.76 6.02,16.92 J1.P$2
USER_BTN  (via drill 0.3)
  Top 0.203: v22.81,17.14 21.84,16.17 21.84,15.66 21.97,15.54 21.97,8.86 22,8.83 U3.P$57 | v35.56,15.92 35.2,15.56 35.2,10.76
  Top 0.254: 35.2,10.76 35.2,10.28 34.13,9.21 31.37,9.21 SW2.1_1
  Bottom 0.203: v22.81,17.14 22.96,16.98 34.49,16.98 v35.56,15.92
VBAT  (via drill 0.3 pad 0.25, 0.5 pad 0.25)
  Top 0.254: U1.P$7 3.16,26.66 v3.49,26.99 | U1.P$3 U1.P$2 4.84,23.4 4.84,23.57 v5.4,23.57 | v4.76,25.32 4.52,25.07 U1.P$5
  Top 0.813: C8.2 3.49,27.8 v3.49,27.86
  Bottom 0.254: v3.49,26.99 4.29,26.99 4.76,26.51 v4.76,25.32 5,25.32 5.64,24.69 5.64,23.81 v5.4,23.57
  Bottom 0.813: v3.49,26.99 v3.49,27.86 6.11,30.48 J6.2
VCAP_1
  Top 0.254: U3.P$31 18.5,21.53 C10.1
VCAP_2
  Top 0.254: 14.76,9.98 C11.1 14.61,11.03 15.01,11.43 U3.P$47
VUSB  (via drill 0.36)
  Top 0.254: 6.75,19.68 7.14,20.08 7.14,21.03 6.91,21.27 6.67,21.27 5.87,22.07 U1.P$16
  Top 0.305: v6.02,17.59 5.98,17.57 | U3.P$42 13.05,13.93 12.06,14.92 10.79,14.92 8.33,17.38 6.23,17.38 v6.02,17.59 | 6.15,17.46 v6.02,17.59
  Top 0.406: J1.P$1 5.98,17.57 6.75,18.34 6.75,19.68
  Bottom 0.305: v6.02,17.59 4.37,17.59 C7.2

### Text on the board
bDocu: xNEMO r1.1 | bnahill@gmail.com